# Altium schematic sheet Emech.SchDoc
size A4; SheetNumber: 1; SheetTotal: 4
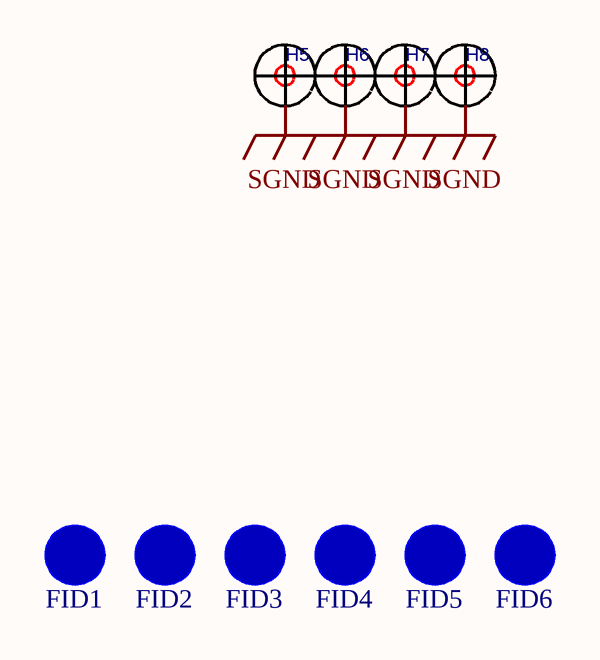
[diagram p0: Emech.SchDoc]

## Parts
FID1  FID_1MM_SMALL  [FID_40X52D]  (value not drawn)  (no BOM)
FID2  FID_1MM_SMALL  [FID_40X52D]  (value not drawn)  (no BOM)
FID3  FID_1MM_SMALL  [FID_40X52D]  (value not drawn)  (no BOM)
FID4  FID_1MM_SMALL  [FID_40X52D]  (value not drawn)  (no BOM)
FID5  FID_1MM_SMALL  [FID_40X52D]  (value not drawn)  (no BOM)
FID6  FID_1MM_SMALL  [FID_40X52D]  (value not drawn)  (no BOM)
H5  HOLE  [HOLE_Φ3_3]  (value not drawn)
H6  HOLE  [HOLE_Φ3_3]  (value not drawn)
H7  HOLE  [HOLE_Φ3_3]  (value not drawn)
H8  HOLE  [HOLE_Φ3_3]  (value not drawn)

## Nets
SGND: H5.1 H6.1 H7.1 H8.1

## Library data of the parts
FID1-FID6 = FID_1MM_SMALL: Fiducial 40mil Diameter, 52mil Mask; Supplier: Digikey
H5-H8 = HOLE: CLASS: IC; CAD_APPROVED: Yes; MFG_PN01: TP-105-01-09; MFG_NAME01: COMPONENTS CORPORATION; AGILE_PN: 210-75685; HEIGHT: 4.8 MM; ROHS: Yes